# Altium project FPGA Breakout.PrjPcb
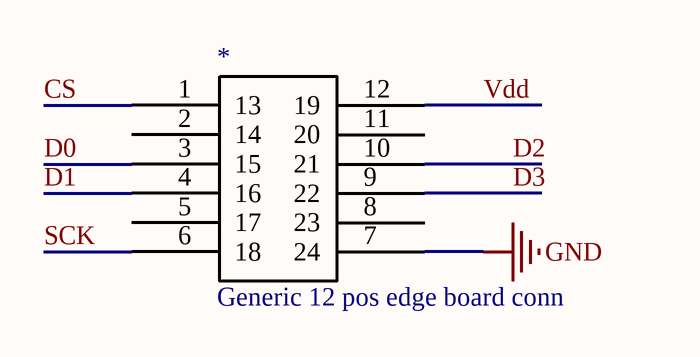
[diagram p0: FPGA Breakout.SchDoc]
1 sheet, 1 parts. Net scope: global (net labels, ports and power ports of the same name join across sheets).

## Sheet FPGA Breakout.SchDoc
size A4; SheetNumber: 1; SheetTotal: 1

### Parts
*  Generic 12 pos edge board conn  [55650118-3]

### Nets
GND: *.7(24)
CS: *.1(13)
D0: *.3(15)
D1: *.4(16)
D2: *.10(21)
D3: *.9(22)
SCK: *.6(18)
Vdd: *.12(19)

Not connected (* = marked no-connect by the designer): * 2(14) 5(17) 8(23) 11(20)